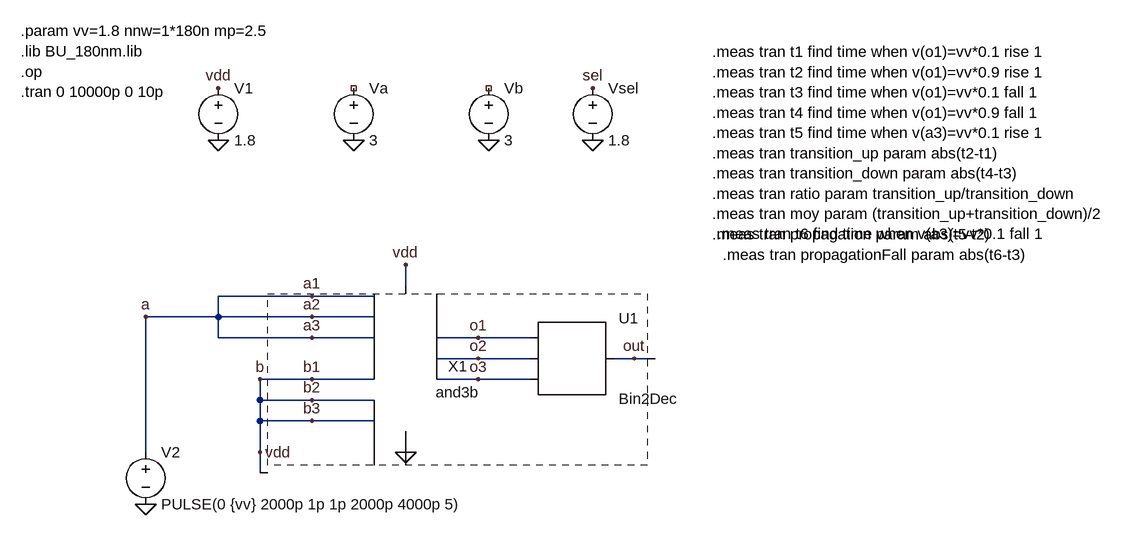
[diagram p0: schematic and3b_test_trans.asc]
and3b_test_trans.asc, the LTspice schematic file:
Version 4
SHEET 1 1584 680
WIRE 432 208 432 176
WIRE 288 224 144 224
WIRE 384 224 288 224
WIRE 144 256 144 224
WIRE 144 256 32 256
WIRE 288 256 144 256
WIRE 384 256 288 256
WIRE 144 288 144 256
WIRE 288 288 144 288
WIRE 384 288 288 288
WIRE 544 288 480 288
WIRE 624 288 544 288
WIRE 544 320 480 320
WIRE 624 320 544 320
WIRE 784 320 752 320
WIRE 816 320 784 320
WIRE 288 352 208 352
WIRE 384 352 288 352
WIRE 544 352 480 352
WIRE 624 352 544 352
WIRE 208 384 208 352
WIRE 288 384 208 384
WIRE 384 384 288 384
WIRE 208 416 208 384
WIRE 288 416 208 416
WIRE 384 416 288 416
WIRE 32 464 32 256
WIRE 208 464 208 416
WIRE 432 464 432 432
WIRE 208 496 208 464
FLAG 784 320 out
FLAG 432 176 vdd
FLAG 432 464 0
FLAG 144 -16 0
FLAG 352 -16 0
FLAG 560 -16 0
FLAG 144 -96 vdd
FLAG 32 256 a
FLAG 208 352 b
FLAG 720 -16 0
FLAG 720 -96 sel
FLAG 544 288 o1
FLAG 544 320 o2
FLAG 544 352 o3
FLAG 288 224 a1
FLAG 288 256 a2
FLAG 288 288 a3
FLAG 288 352 b1
FLAG 288 384 b2
FLAG 288 416 b3
FLAG 208 464 vdd
FLAG 32 544 0
SYMBOL Bin2Dec 688 320 R0
SYMATTR InstName U1
SYMATTR SpiceLine Vhigh={vv}
SYMBOL /voltage 144 -112 R0
SYMATTR InstName V1
SYMATTR Value 1.8
SYMBOL /voltage 352 -112 R0
SYMATTR InstName Va
SYMATTR Value 3
SYMBOL /voltage 560 -112 R0
SYMATTR InstName Vb
SYMATTR Value 3
SYMBOL /voltage 720 -112 R0
SYMATTR InstName Vsel
SYMATTR Value 1.8
SYMBOL and3b 432 320 R0
SYMATTR InstName X1
SYMATTR SpiceLine ll=180n wp={nnw*mp} wn={nnw}
SYMBOL /voltage 32 448 R0
SYMATTR InstName V2
SYMATTR Value PULSE(0 {vv} 2000p 1p 1p 2000p 4000p 5)
TEXT -160 -184 Left 2 !.param vv=1.8 nnw=1*180n mp=2.5\n.lib BU_180nm.lib\n.op\n.tran 0 10000p 0 10p
TEXT 904 -152 Left 2 !.meas tran t1 find time when v(o1)=vv*0.1 rise 1\n.meas tran t2 find time when v(o1)=vv*0.9 rise 1\n.meas tran t3 find time when v(o1)=vv*0.1 fall 1\n.meas tran t4 find time when v(o1)=vv*0.9 fall 1\n.meas tran t5 find time when v(a3)=vv*0.1 rise 1\n.meas tran transition_up param abs(t2-t1)\n.meas tran transition_down param abs(t4-t3)\n.meas tran ratio param transition_up/transition_down\n.meas tran moy param (transition_up+transition_down)/2\n.meas tran propagation param abs(t5-t2)
TEXT 912 128 Left 2 !.meas tran t6 find time when v(a3)=vv*0.1 fall 1
TEXT 920 160 Left 2 !.meas tran propagationFall param abs(t6-t3)

The netlist it stands for:
* and3b_test_trans.asc
XU1 o1 o2 o3 out Bin2Dec Vhigh={vv}
V1 b3 0 1.8
Va NC_01 0 3
Vb NC_02 0 3
Vsel sel 0 1.8
* X1: and3b ll=180n wp={nnw*mp} wn={nnw} (symbol and3b not available, pin order unknown); nets seen at it: 0, a3, b3, o1, o2, o3, out
V2 a3 0 PULSE(0 {vv} 2000p 1p 1p 2000p 4000p 5)
.param vv=1.8 nnw=1*180n mp=2.5
.lib BU_180nm.lib
.op
.tran 0 10000p 0 10p
.meas tran t1 find time when v(o1)=vv*0.1 rise 1
.meas tran t2 find time when v(o1)=vv*0.9 rise 1
.meas tran t3 find time when v(o1)=vv*0.1 fall 1
.meas tran t4 find time when v(o1)=vv*0.9 fall 1
.meas tran t5 find time when v(a3)=vv*0.1 rise 1
.meas tran transition_up param abs(t2-t1)
.meas tran transition_down param abs(t4-t3)
.meas tran ratio param transition_up/transition_down
.meas tran moy param (transition_up+transition_down)/2
.meas tran propagation param abs(t5-t2)
.meas tran t6 find time when v(a3)=vv*0.1 fall 1
.meas tran propagationFall param abs(t6-t3)
.lib BIN2DEC.sub
.backanno
.end